# Altium project DATN_HUST.PrjPcb
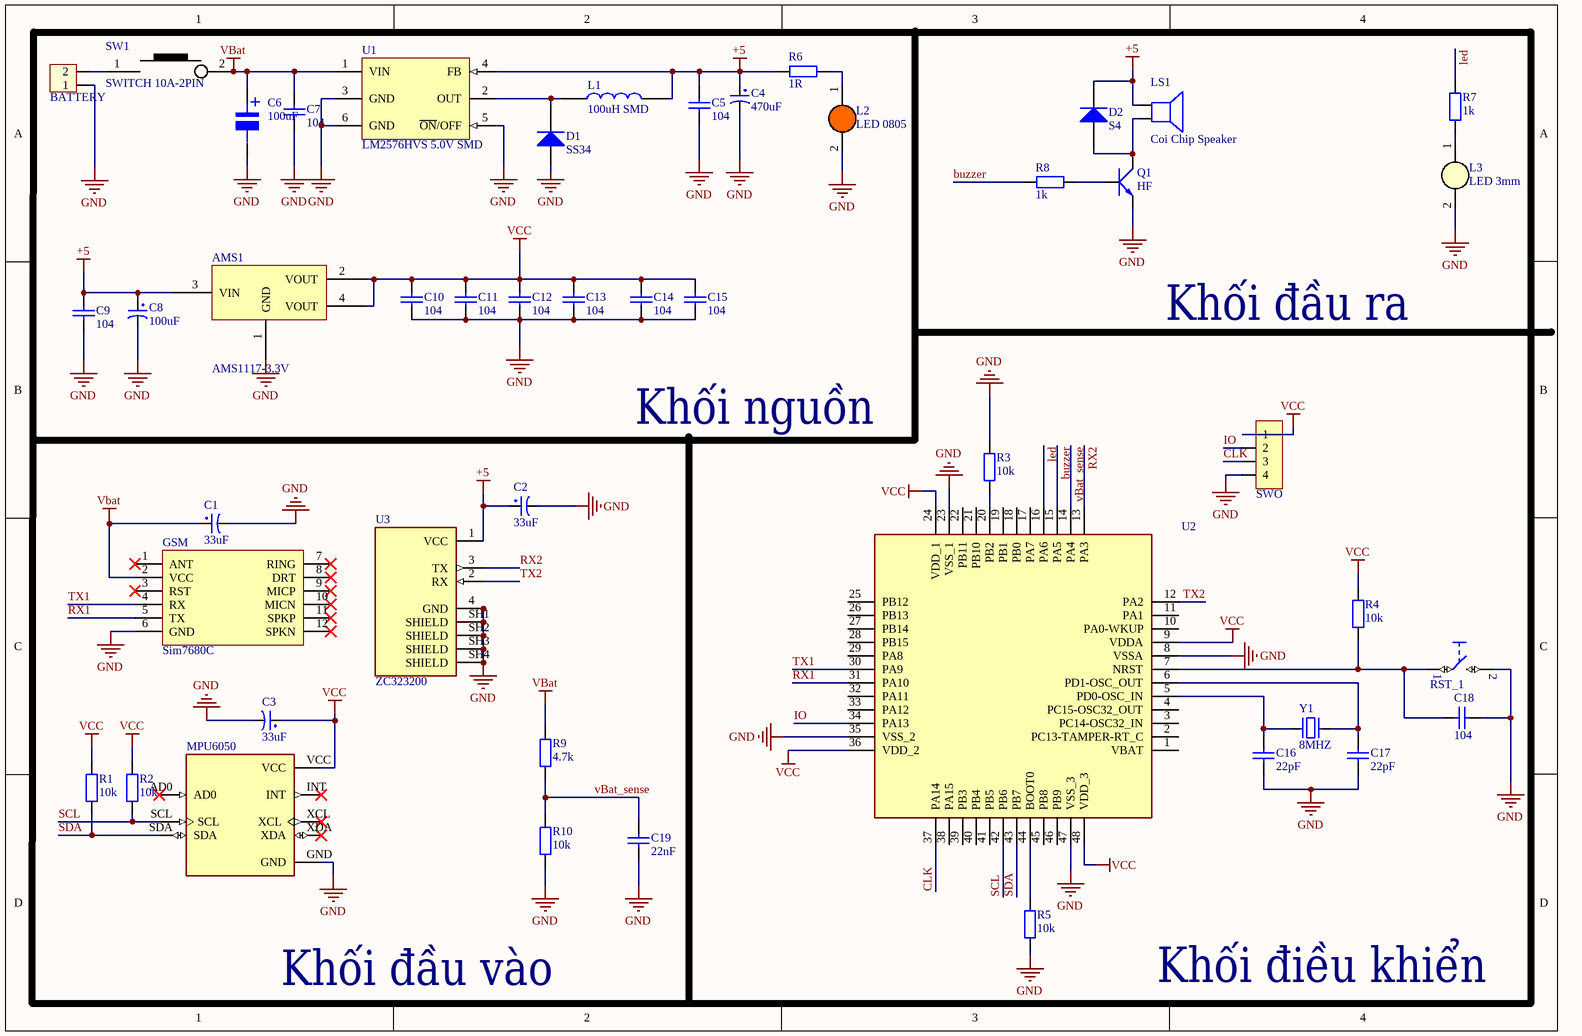
[diagram p0: Sheet2.SchDoc]
1 sheet, 47 parts. Net scope: global (net labels, ports and power ports of the same name join across sheets).
Board file: PCB2.PcbDoc

## Sheet Sheet2.SchDoc
size A4; SheetNumber: 1; SheetTotal: 1

### Parts
AMS1  AMS1117-3.3V  [SOT223]
C1  33uF  [tu tantalum smd3216]
C2  33uF  [tu tantalum smd3216]
C3  33uF  [tu tantalum smd3216]
C4  470uF  [tu tantalum smd7343]
C5  104  [tu gom]
C6  100uF  [tu nhom 8 (f)]
C7  104  [tu gom]
C8  100uF  [tu tantalum smd7343]
C9  104  [tu 0603]
C10  104  [tu 0603]
C11  104  [tu 0603]
C12  104  [tu 0603]
C13  104  [tu 0603]
C14  104  [tu 0603]
C15  104  [tu 0603]
C16  22pF  [tu 0603]
C17  22pF  [tu 0603]
C18  104  [tu 0603]
C19  22nF  [tu 0603]
D1  SS34  [DIODE SMA]
D2  S4  [DIODE SOD-123]
GSM  Sim7680C  [Sim800L]
H?  BATTERY  [XH2.54M-2]
JP3  SWO  [JP 1x4 DT]
L1  100uH SMD  [Cuon Cam 7x7x5]
L2  LED 0805  [LED-0805-Orange]
L3  LED 3mm  [LED-3MM-WHITE]
LS1  Coi Chip Speaker  [Coi Chip Speacker]
MPU6050  (no value)  [MODULE_OC09600]
Q1  HF  [SOT-23]
R1  10k  [tro smd 0603]
R2  10k  [tro smd 0603]
R3  10k  [tro smd 0603]
R4  10k  [tro smd 0603]
R5  10k  [tro smd 0603]
R6  1R  [tro smd 0603]
R7  1k  [tro smd 0603]
R8  1k  [tro smd 0603]
R9  4.7k  [tro smd 0603]
R10  10k  [tro smd 0603]
RST_1  B3U1000P  [B3U-1000P]  (value not drawn)
SW1  SWITCH 10A-2PIN  [SW_2ARS_TH]
U1  LM2576HVS 5.0V SMD  [TO263-5]
U2  STM32F103C8T6  [LQFP-48_19.6_393_58X11_SMD]  (value not drawn)
U3  ZC323200  [XCVR_ZC323200]
Y1  8MHZ  [Thach Anh 2 chan SMD]

### Nets
+5: AMS1.3(VIN) C2.1 C4.1 C5.1 C8.1 C9.1 D2.2(K) L1.2 LS1.1 R6.1 U1.4(FB) U3.1(VCC)
GND: AMS1.1(GND) C1.2 C2.2 C3.2 C4.2 C5.2 C6.2 C7.2 C8.2 C9.2 C10.2 C11.2 C12.2 C13.2 C14.2 C15.2 C16.2 C17.2 C18.2 C19.1 D1.1(A) GSM.6(GND) H?.1 JP3.4 L2.2(K) L3.2(K) MPU6050.GND Q1.2(E) R3.2 R5.1 R10.1 RST_1.2 U1.3(GND) U1.5(~{ON}/OFF) U1.6(GND) U2.8(VSSA) U2.23(VSS_1) U2.35(VSS_2) U2.47(VSS_3) U3.4(GND) U3.SH1(SHIELD) U3.SH2(SHIELD) U3.SH3(SHIELD) U3.SH4(SHIELD)
VBat: C1.1 C6.1 C7.1 GSM.2(VCC) R9.2 SW1.2 U1.1(VIN)
VCC: AMS1.2(VOUT) AMS1.4(VOUT) C3.1 C10.1 C11.1 C12.1 C13.1 C14.1 C15.1 JP3.1 MPU6050.VCC R1.2 R2.2 R4.2 U2.9(VDDA) U2.24(VDD_1) U2.36(VDD_2) U2.48(VDD_3)
buzzer: R8.2 U2.15(PA5)
CLK: JP3.3 U2.37(PA14)
IO: JP3.2 U2.34(PA13)
led: R7.2 U2.16(PA6)
RX1: GSM.5(TX) U2.31(PA10)
RX2: U2.13(PA3) U3.3(TX)
SCL: MPU6050.SCL R2.1 U2.42(PB6)
SDA: MPU6050.SDA R1.1 U2.43(PB7)
TX1: GSM.4(RX) U2.30(PA9)
TX2: U2.12(PA2) U3.2(RX)
vBat_sense: C19.2 R9.1 R10.2 U2.14(PA4)
NetC16_1: C16.1 U2.5(PD0-OSC_IN) Y1.2
NetC17_1: C17.1 U2.6(PD1-OSC_OUT) Y1.1
NetC18_1: C18.1 R4.1 RST_1.1 U2.7(NRST)
NetD1_2: D1.2(K) L1.1 U1.2(OUT)
NetD2_1: D2.1(A) LS1.2 Q1.3(C)
NetH?_2: H?.2 SW1.1
NetL2_1: L2.1(A) R6.2
NetL3_1: L3.1(A) R7.1
NetQ1_1: Q1.1(B) R8.1
NetR3_1: R3.1 U2.20(PB2)
NetR5_2: R5.2 U2.44(BOOT0)

Not connected (* = marked no-connect by the designer): GSM 1(ANT)* 3(RST)* 7(RING)* 8(DRT)* 9(MICP)* 10(MICN)* 11(SPKP)* 12(SPKN)*; MPU6050 AD0* INT* XCL* XDA*; U2 1(VBAT) 2(PC13-TAMPER-RT_C) 3(PC14-OSC32_IN) 4(PC15-OSC32_OUT) 10(PA0-WKUP) 11(PA1) 17(PA7) 18(PB0) 19(PB1) 21(PB10) 22(PB11) 25(PB12) 26(PB13) 27(PB14) 28(PB15) 29(PA8) 32(PA11) 33(PA12) 38(PA15) 39(PB3) 40(PB4) 41(PB5) 45(PB8) 46(PB9)

### Notes on the sheet
- Khối đầu ra
- Khối nguồn
- Khối điều khiển
- Khối đầu vào
- (in symbol Tu Nhom 100uF 50V) +

### Library data of the parts
AMS1 = AMS1117 SMD: Dán; Value: AMS1117-3.3V SOT223; Don_Vi: Con; Ma_Hang: MH000596; Ghi_Chu: *; Kieu_Chan: *; Chung_Loai: Dán
C1-C3 = Tu tantalum 33uF 6.3V SMD3216: Dán; Don_Vi: Con; So_Chan: 2; Ten_Linh_Kien: Tụ tantalum J336-33uF 6.3V SMD3216; Ma_Hang: MH008674; Chung_Loai: Dán; Kieu_Chan: *
C4 = Tu tantalum 470uF 10V SMD7343: Dán; Don_Vi: Con; So_Chan: 2; Ten_Linh_Kien: Tụ tantalum 477A-470uF 10V SMD7343; Ma_Hang: MH001956; Chung_Loai: Dán; Kieu_Chan: *
C5 C7 = Tu gom 104 50V: Cắm; So_Chan: 2; Ten_Linh_Kien: Tụ gốm 104 100nF 50V; Don_Vi: Con; Ma_Hang: MH004761; Chung_Loai: Cắm; Kieu_Chan: *
C6 = Tu Nhom 100uF 50V: Dán; Don_Vi: Con; So_Chan: 2; Ten_Linh_Kien: Tụ Nhôm 100uF 50V 8x10.2MM; Ma_Hang: MH002223; Chung_Loai: Dán; Kieu_Chan: *
C8 = Tu tantalum 100uF 16V SMD7343: Dán; Don_Vi: Con; So_Chan: 2; Ten_Linh_Kien: Tụ tantalum 107C-100uF 16V SMD7343; Ma_Hang: MH002346; Chung_Loai: Dán; Kieu_Chan: *
C9-C15 C18 C19 = Tu 0603 101 50V 10%: Dán; Don_Vi: Con; So_Chan: 2; Ten_Linh_Kien: Tụ 0603 101-0.1nF 10% 50V; Ma_Hang: MH004565; Chung_Loai: Dán; Kieu_Chan: *
C16 C17 = Tu 0603 22pF 50V 10%: Dán; Don_Vi: Con; So_Chan: 2; Ten_Linh_Kien: Tụ 0603 22pF 50V 10%; Ma_Hang: MH004570; Chung_Loai: Dán; Kieu_Chan: *
D1 = Diode SS34 ( 1N5822 ): Dán; Don_Vi: Con; Ma_Hang: MH002104; Ten_Linh_Kien: Diode SS34 3A 40V SMA ( 1N5822 SS34A); Kieu_Chan: *; Chung_Loai: Dán
D2 = Diode S4: Dán; Ten_Linh_Kien: Diode S4 SOD123 ( 1N5819 SOD123); Ma_Hang: MH005519; Don_Vi: Con; Ghi_Chu: *; Chung_Loai: Dán; Kieu_Chan: *
GSM = Sim800L
H? = Header 2P 2.54 Duc Thang: Cắm; Ten_Linh_Kien: Header 2P XH2.54-2P Đực Thẳng; Don_Vi: Con; Ma_Hang: MH001283; Chung_Loai: Cắm
JP3 = JP 1x4 2.54 Duc Thang: Cắm; Ten_Linh_Kien: Jump Đơn Đực 2.54MM 1x40P Thẳng 11MM; Don_Vi: Con; Ma_Hang: MH000903; Ghi_Chu: *; Kieu_Chan: *; Chung_Loai: Cắm
L1 = CUON CAM 47uH SMD: Dán; Don_Vi: Con; Ma_Hang: MH004211; Ten_Linh_Kien: Cuộn Cảm 47uH 7x7x4MM CD74R; Ghi_Chu: *; Kieu_Chan: *; Chung_Loai: Dán
L2 = LED 0805 Cam: Dán; Don_Vi: Con; Ma_Hang: MH002328; Ten_Linh_Kien: LED 0805 Màu Cam ( Orange); Ghi_Chu: *; Kieu_Chan: *; Chung_Loai: Dán
L3 = LED 3mm Trang: Cắm; Don_Vi: Con; Ma_Hang: MH009001; Ten_Linh_Kien: LED 3MM Trắng SS (1000c); Ghi_Chu: *; Kieu_Chan: *; Chung_Loai: Cắm
LS1 = Coi Chip Speaker: Còi chip
MPU6050 = OC09600: GY-521 6 DOF MPU-6050 Module 3 Axis Accelerometer Gyroscope Module for Arduino; MF: YKS; SnapEDA_Link: https://www.snapeda.com/parts/OC09600/YKS/view-part/?ref=snap; Package: None; Value: *; MP: OC09600; Check_prices: https://www.snapeda.com/parts/OC09600/YKS/view-part/?ref=eda
Q1 = Trans C1815 HF SMD: SOT-23; Value: C9014
R1 R2 = Tro 0603 5% 10k: Dán; Don_Vi: Con; So_Chan: 2; Ten_Linh_Kien: Trở 0603 5% 10k; Ma_Hang: MH006316; Chung_Loai: Dán; Kieu_Chan: *
R3-R5 R7-R10 = Tro 0603 1% 10k: Dán; Don_Vi: Con; So_Chan: 2; Ten_Linh_Kien: Trở 0603 1% 10k; Ma_Hang: MH006333; Chung_Loai: Dán; Kieu_Chan: *
R6 = Tro 0603 5% 1R: Dán; Don_Vi: Con; So_Chan: 2; Ten_Linh_Kien: Trở 0603 5% 1R; Ma_Hang: MH006320; Chung_Loai: Dán; Kieu_Chan: *
RST_1 = B3U1000P: Switch Tactile N.O. SPST Round Button Gull Wing 0.05A 12VDC 1.5N SMD T/R; MF: Omron; MP: B3U1000P; SnapEDA_Link: https://www.snapeda.com/parts/B3U1000P/Omron/view-part/?ref=snap; Value: *; Package: None; Price: None; Availability: In Stock; Check_prices: https://www.snapeda.com/parts/B3U1000P/Omron/view-part/?ref=eda
SW1 = SW1_RS-471005264153-TH: Rocker Switch SPST 16A (AC), 10A (DC) 250V Panel Mount, Snap-In; Manufacturer: Würth Elektronik; Alternate Part Number-1: NA; Manufacturer Part Number: 471005264153; Case/Package: TH; Supplier-1: Würth Elektronik; Supplier Part Number-1: 471005264153
U1 = LM2576HVS 5.0V SMD: Dán; Ten_Linh_Kien: LM2576HVS-5.0V BUCK 5V 3A TO263-5; Don_Vi: Con; Ma_Hang: MH002362; Ghi_Chu: *; Kieu_Chan: *; Chung_Loai: Dán
U2 = IC_STM32F103C8T6: ARM® Cortex®-M3 STM32F1 Microcontroller IC 32-Bit 72MHz 64KB (64K x 8) FLASH 48-LQFP (7x7); Manufacturer: STMicroelectronics; Alternate Part Number-1: NA; Manufacturer Part Number: STM32F103C8T6; Case/Package: LQFP48; Supplier-1: LCSC; Supplier Part Number-1: STM32F103C8T6
U3 = ZC323200: GY-NEO6MV2 GY-GPS6MV2 NEO-6M GPS Module with Flight Control APM2.5; MF: YKS; SnapEDA_Link: https://www.snapeda.com/parts/ZC323200/YKS/view-part/?ref=snap; Package: None; Value: *; MP: ZC323200; Check_prices: https://www.snapeda.com/parts/ZC323200/YKS/view-part/?ref=eda
Y1 = Thach Anh 2 chan SMD: Crystal For all Crystal 2pin.; Value: 4Mhz